# Altium schematic sheet uC.SchDoc
size A3
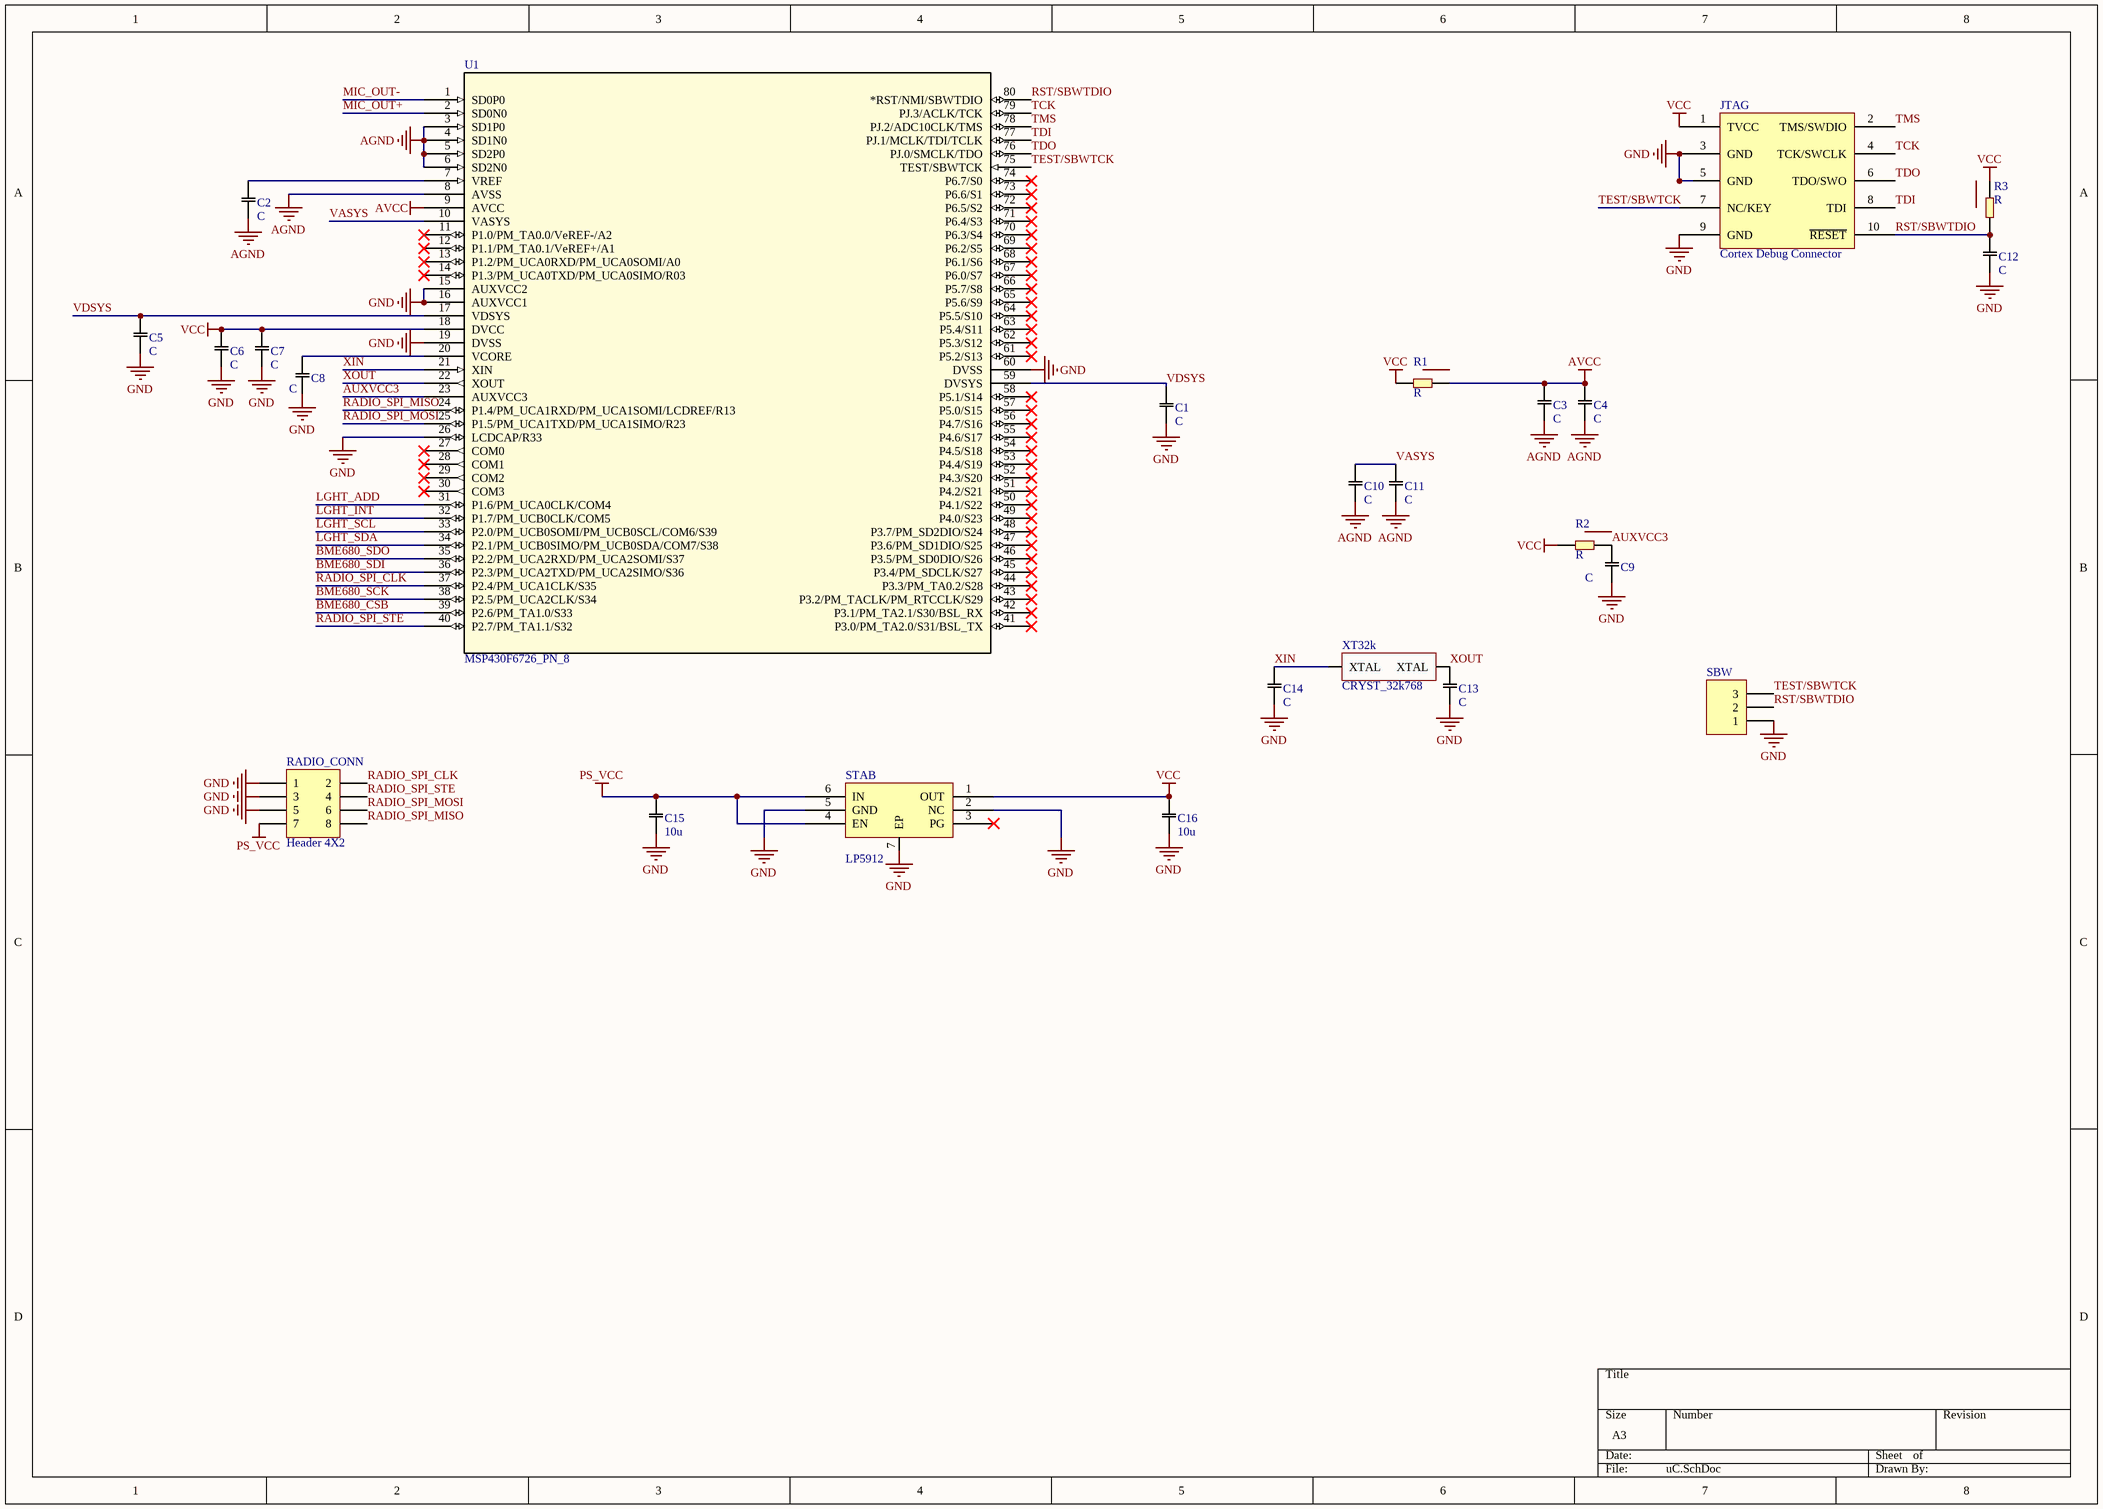
[diagram p0: uC.SchDoc]

## Parts
C1  C  [402]
C2  C  [402]
C3  C  [402]
C4  C  [402]
C5  C  [402]
C6  C  [402]
C7  C  [402]
C8  C  [402]
C9  C  [402]
C10  C  [402]
C11  C  [402]
C12  C  [402]
C13  C  [402]
C14  C  [402]
C15  10u  [402]
C16  10u  [402]
JTAG  Cortex Debug Connector  [JTAG_HEADER]
R1  R  [402]
R2  R  [402]
R3  R  [402]
RADIO_CONN  Header 4X2  [HDR2X4]
SBW  (no value)  [HDR1X3]
STAB  LP5912  [WSON-6]
U1  MSP430F6726_PN_8  [PN80-L]
XT32k  CRYST_32k768  [CRYST 32.768 kHz]

## Nets
AGND: C2.1 C3.1 C4.1 C10.1 C11.1 U1.3(SD1P0) U1.4(SD1N0) U1.5(SD2P0) U1.6(SD2N0) U1.8(AVSS)
AVCC: C3.2 C4.2 R1.2 U1.9(AVCC)
GND: C1.1 C5.1 C6.1 C7.1 C8.1 C9.1 C12.1 C13.1 C14.1 C15.1 C16.1 JTAG.3(GND) JTAG.5(GND) JTAG.9(GND) RADIO_CONN.1 RADIO_CONN.3 RADIO_CONN.5 SBW.1 STAB.2(NC) STAB.5(GND) STAB.7(EP) U1.15(AUXVCC2) U1.16(AUXVCC1) U1.19(DVSS) U1.26(LCDCAP/R33) U1.60(DVSS)
PS_VCC: C15.2 RADIO_CONN.7 STAB.4(EN) STAB.6(IN)
VCC: C6.2 C7.2 C16.2 JTAG.1(TVCC) R1.1 R2.1 R3.2 STAB.1(OUT) U1.18(DVCC)
AUXVCC3: C9.2 R2.2 U1.23(AUXVCC3)
BME680_CSB: U1.39(P2.6/PM_TA1.0/S33)
BME680_SCK: U1.38(P2.5/PM_UCA2CLK/S34)
BME680_SDI: U1.36(P2.3/PM_UCA2TXD/PM_UCA2SIMO/S36)
BME680_SDO: U1.35(P2.2/PM_UCA2RXD/PM_UCA2SOMI/S37)
LGHT_ADD: U1.31(P1.6/PM_UCA0CLK/COM4)
LGHT_INT: U1.32(P1.7/PM_UCB0CLK/COM5)
LGHT_SCL: U1.33(P2.0/PM_UCB0SOMI/PM_UCB0SCL/COM6/S39)
LGHT_SDA: U1.34(P2.1/PM_UCB0SIMO/PM_UCB0SDA/COM7/S38)
MIC_OUT+: U1.2(SD0N0)
MIC_OUT-: U1.1(SD0P0)
RADIO_SPI_CLK: RADIO_CONN.2 U1.37(P2.4/PM_UCA1CLK/S35)
RADIO_SPI_MISO: RADIO_CONN.8 U1.24(P1.4/PM_UCA1RXD/PM_UCA1SOMI/LCDREF/R13)
RADIO_SPI_MOSI: RADIO_CONN.6 U1.25(P1.5/PM_UCA1TXD/PM_UCA1SIMO/R23)
RADIO_SPI_STE: RADIO_CONN.4 U1.40(P2.7/PM_TA1.1/S32)
RST/SBWTDIO: C12.2 JTAG.10(~{RESET}) R3.1 SBW.2 U1.80(*RST/NMI/SBWTDIO)
TCK: JTAG.4(TCK/SWCLK) U1.79(PJ.3/ACLK/TCK)
TDI: JTAG.8(TDI) U1.77(PJ.1/MCLK/TDI/TCLK)
TDO: JTAG.6(TDO/SWO) U1.76(PJ.0/SMCLK/TDO)
TEST/SBWTCK: JTAG.7(NC/KEY) SBW.3 U1.75(TEST/SBWTCK)
TMS: JTAG.2(TMS/SWDIO) U1.78(PJ.2/ADC10CLK/TMS)
VASYS: C10.2 C11.2 U1.10(VASYS)
VDSYS: C1.2 C5.2 U1.17(VDSYS) U1.59(DVSYS)
XIN: C14.2 U1.21(XIN) XT32k.2(XTAL)
XOUT: C13.2 U1.22(XOUT) XT32k.1(XTAL)
NetC2_2: C2.2 U1.7(VREF)
NetC8_2: C8.2 U1.20(VCORE)

Not connected (* = marked no-connect by the designer): STAB 3(PG)*; U1 11(P1.0/PM_TA0.0/VeREF-/A2)* 12(P1.1/PM_TA0.1/VeREF+/A1)* 13(P1.2/PM_UCA0RXD/PM_UCA0SOMI/A0)* 14(P1.3/PM_UCA0TXD/PM_UCA0SIMO/R03)* 27(COM0)* 28(COM1)* 29(COM2)* 30(COM3)* 41(P3.0/PM_TA2.0/S31/BSL_TX)* 42(P3.1/PM_TA2.1/S30/BSL_RX)* 43(P3.2/PM_TACLK/PM_RTCCLK/S29)* 44(P3.3/PM_TA0.2/S28)* 45(P3.4/PM_SDCLK/S27)* 46(P3.5/PM_SD0DIO/S26)* 47(P3.6/PM_SD1DIO/S25)* 48(P3.7/PM_SD2DIO/S24)* 49(P4.0/S23)* 50(P4.1/S22)* 51(P4.2/S21)* 52(P4.3/S20)* 53(P4.4/S19)* 54(P4.5/S18)* 55(P4.6/S17)* 56(P4.7/S16)* 57(P5.0/S15)* 58(P5.1/S14)* 61(P5.2/S13)* 62(P5.3/S12)* 63(P5.4/S11)* 64(P5.5/S10)* 65(P5.6/S9)* 66(P5.7/S8)* 67(P6.0/S7)* 68(P6.1/S6)* 69(P6.2/S5)* 70(P6.3/S4)* 71(P6.4/S3)* 72(P6.5/S2)* 73(P6.6/S1)* 74(P6.7/S0)*

## Library data of the parts
C1-C16 = C: Capacitor
R1-R3 = R: Resistor
RADIO_CONN = Header 4X2: Header, 4-Pin, Dual row; LatestRevisionDate: 17-Jul-2002; LatestRevisionNote: Re-released for DXP Platform.; Publisher: Altium Limited
SBW = Header 3: Header, 3-Pin; LatestRevisionDate: 17-Jul-2002; LatestRevisionNote: Re-released for DXP Platform.; Publisher: Altium Limited
U1 = MSP430F6726_PN_8: Imported; Manufacturer_Part_Number: msp430f6726_pn_80; Vendor: Texas Instruments; PACKAGE_DESIGNATOR: PN; PIN_COUNT: 80; FAMILY_NAME: 6 Series with LCD; INDUSTRY_STD_PKG_TYPE: LQFP; GENERIC_PART_NUMBER: MSP430F6726; Manufacturer: Texas Instruments; Datasheet_URL: http://www.ti.com/lit/gpn/MSP430F6726; Value: Value; Type: Type; RefDes: RefDes